# Altium schematic sheet BLV.SchDoc
size 210 x 83 mm
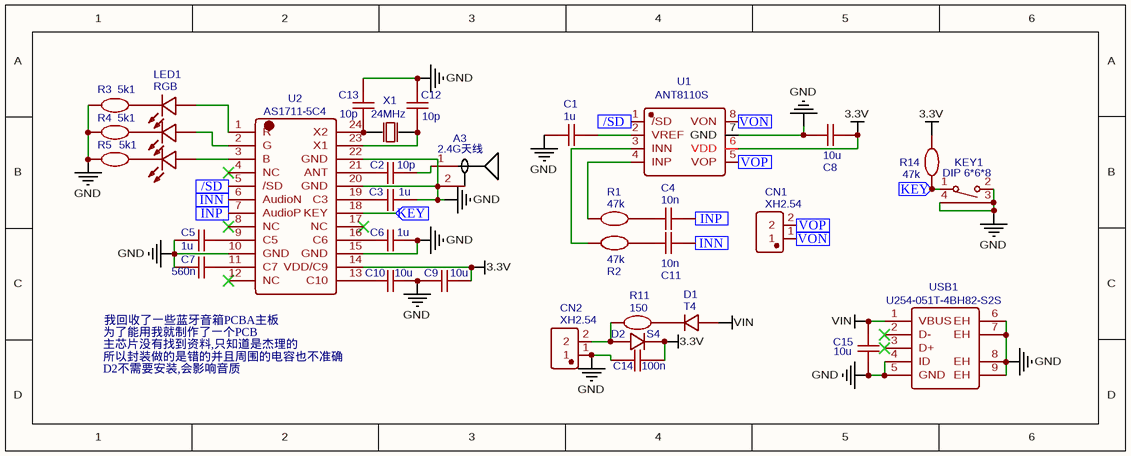
[diagram p0: BLV.SchDoc]

## Parts
A3  2.4G天线  [ANT-RF-BT6-2.4G]
C1  1u  [C0603]
C2  10p  [C0603]
C3  1u  [C0603]
C4  10n  [C0603]
C5  1u  [C0603]
C6  1u  [C0603]
C7  560n  [C0603]
C8  10u  [C0805]
C9  10u  [C0603]
C10  10u  [C0603]
C11  10n  [C0603]
C12  10p  [C0603]
C13  10p  [C0603]
C14  100n  [C0805]
C15  10u  [C0805]
CN1  XH2.54  [XH2.54-LI-2P]
CN2  XH2.54  [XH2.54-LI-2P]
D1  T4  [SOD-123]
D2  S4  [SOD-123]
KEY1  DIP 6*6*8  [TSW DIP-6*6*8]
LED1  RGB  [LED 5050]
R1  47k  [R0603]
R2  47k  [R0603]
R3  5k1  [R0603]
R4  5k1  [R0603]
R5  5k1  [R0603]
R11  150  [R0603]
R14  47k  [R0603]
U1  ANT8110S  [SOP8]
U2  AS1711-5C4  [QSOP24]
USB1  U254-051T-4BH82-S2S  [USB-MICRO_B]
X1  24MHz  [49XSMD]

## Ports
/SD (in), INN (in), INP (in), KEY (in), VON (in), VOP (in)

## Nets
3.3V: C8.1 C9.2 C14.2 D2.1(K) R14.2 U1.6(VDD) U2.14(VDD/C9)
GND: A3.2 C1.2 C3.2 C5.1 C6.2 C7.1 C8.2 C9.1 C10.2 C12.2 C13.2 C14.1 C15.2 CN2.1 KEY1.2 KEY1.3 KEY1.4 R3.1 R4.1 R5.1 U1.7(GND) U2.10(GND) U2.15(GND) U2.20(GND) U2.22(GND) USB1.4(ID) USB1.5(GND) USB1.6(EH) USB1.7(EH) USB1.8(EH) USB1.9(EH)
VIN: C15.1 D1.2(A) USB1.1(VBUS)
/SD: U1.1(/SD) U2.5(/SD) ; port /SD
INN: C11.1 U2.6(AudioN) ; port INN
INP: C4.1 U2.7(AudioP) ; port INP
KEY: KEY1.1 R14.1 U2.18(KEY) ; port KEY
VON: CN1.1 U1.8(VON) ; port VON
VOP: CN1.2 U1.5(VOP) ; port VOP
NetA3_1: A3.1 C2.2
NetC1_1: C1.1 U1.2(VREF)
NetC2_1: C2.1 U2.21(ANT)
NetC3_1: C3.1 U2.19(C3)
NetC4_2: C4.2 R1.2
NetC5_2: C5.2 U2.9(C5)
NetC6_1: C6.1 U2.16(C6)
NetC7_2: C7.2 U2.11(C7)
NetC10_1: C10.1 U2.13(C10)
NetC11_2: C11.2 R2.2
NetC12_1: C12.1 U2.23(X1) X1.2(OSC2)
NetC13_1: C13.1 U2.24(X2) X1.1(OSC1)
NetCN2_2: CN2.2 D2.2(A) R11.1
NetD1_1: D1.1(K) R11.2
NetLED1_1: LED1.1(C) R5.2
NetLED1_2: LED1.2(C) R4.2
NetLED1_3: LED1.3(C) R3.2
NetLED1_4: LED1.4(A) U2.1(R)
NetLED1_5: LED1.5(A) U2.2(G)
NetLED1_6: LED1.6(A) U2.3(B)
NetR1_1: R1.1 U1.4(INP)
NetR2_1: R2.1 U1.3(INN)

Not connected (* = marked no-connect by the designer): U2 4(NC)* 8(NC)* 12(NC)* 17(NC)*; USB1 2(D-)* 3(D+)*

## Notes on the sheet
- 为了能用我就制作了一个PCB
- 我回收了一些蓝牙音箱PCBA主板
- 主芯片没有找到资料,只知道是杰理的
- 所以封装做的是错的并且周围的电容也不准确
- D2不需要安装,会影响音质

## Library data of the parts
A3 = 2.4G天线: BOM_Manufacturer Part: New SchematicLib; Contributor: suanm; spicePre: U; spiceSymbolName: 2.4G天线_右
C1 C3 C5 C6 = 1u: nameAlias: Value(F); Contributor: LCEDA_Lib; spicePre: C
  C1: spiceSymbolName: C_0805_US
  C3 C5 C6: spiceSymbolName: C_0603_US
C2 C12 C13 = 10p: nameAlias: Value(F); Contributor: LCEDA_Lib; spicePre: C; spiceSymbolName: C_0603_US
C4 C11 = 22n: nameAlias: Value(F); Contributor: LCEDA_Lib; spicePre: C; spiceSymbolName: C_0603_US
C7 = 560n: nameAlias: Value(F); Contributor: LCEDA_Lib; spicePre: C; spiceSymbolName: C_0603_US
C8-C10 C15 = 10u: nameAlias: Value(F); Contributor: LCEDA_Lib; spicePre: C
  C8 C15: spiceSymbolName: C_0805_US
  C9 C10: spiceSymbolName: C_0603_US
C14 = 100n: nameAlias: Value(F); Contributor: LCEDA_Lib; spicePre: C; spiceSymbolName: C_0805_US
CN1 CN2 = XH2.54: BOM_Manufacturer: null; BOM_Manufacturer Part: CONN-TH_XH-2A; Contributor: LCSC; BOM_Supplier: LCSC; BOM_Supplier Part: C9900010848; BOM_JLCPCB Part Class: Extended Part; spicePre: C; spiceSymbolName: CONN-TH_XH-2A_C9900010848
D1 = T4: BOM_Manufacturer: CJ; BOM_Manufacturer Part: 1N4148W T4; Contributor: 立创EDA官方封装库; BOM_Supplier: LCSC; BOM_Supplier Part: C2099; BOM_JLCPCB Part Class: Extended Part; spicePre: D; spiceSymbolName: 1N4148W T4
D2 = S4: BOM_Manufacturer: CJ; BOM_Manufacturer Part: 1N4148W T4; Contributor: 立创EDA官方封装库; BOM_Supplier: LCSC; BOM_Supplier Part: C2099; BOM_JLCPCB Part Class: Extended Part; spicePre: D; spiceSymbolName: 1N4148W T4
KEY1 = DIP 6*6*8: BOM_Manufacturer: 韩国韩荣; BOM_Manufacturer Part: K2-1102AQ-H4CW-01; Contributor: LCSC; BOM_Supplier: LCSC; BOM_Supplier Part: C961738; BOM_JLCPCB Part Class: Extended Part; spicePre: S; spiceSymbolName: K2-1102AQ-H4CW-01
LED1 = RGB: BOM_Manufacturer: Hongli Zhihui (HONGLITRONIC); BOM_Manufacturer Part: HL-AF-5060H271BU46FU79GC-S1-THL; Contributor: LCSC; BOM_Supplier: LCSC; BOM_Supplier Part: C219409; BOM_JLCPCB Part Class: Extended Part; spicePre: L; spiceSymbolName: HL-AF-5060H271BU46FU79GC-S1-THL
R1 R2 = 22k: nameAlias: Value(Ω); Contributor: LCEDA_Lib; spicePre: R; spiceSymbolName: R_0603_EU
R3-R5 = 5k1: nameAlias: Value(Ω); Contributor: LCEDA_Lib; spicePre: R; spiceSymbolName: R_0603_EU
R11 = 150: nameAlias: Value(Ω); Contributor: LCEDA_Lib; spicePre: R; spiceSymbolName: R_0603_EU
R14 = 4k7: nameAlias: Value(Ω); Contributor: LCEDA_Lib; spicePre: R; spiceSymbolName: R_0603_EU
U1 = ANT8110S: BOM_Manufacturer: null; Contributor: LCSC; BOM_Supplier: LCSC; BOM_Supplier Part: C9900000568; BOM_Manufacturer Part: ANT8110S; BOM_JLCPCB Part Class: Extended Part; spicePre: U; spiceSymbolName: ANT8110S
U2 = AS1711-5C4: Contributor: lekee085; BOM_Supplier: JL杰理; spicePre: U; spiceSymbolName: AS1711-5C4
USB1 = U254-051T-4BH82-S2S: BOM_Manufacturer: XKB Connectivity(中国星坤); Contributor: LCSC; BOM_Supplier: LCSC; BOM_Supplier Part: C908456; BOM_Manufacturer Part: U254-051T-4BH82-S2S; BOM_JLCPCB Part Class: Extended Part; spicePre: U; spiceSymbolName: U254-051T-4BH82-S2S
X1 = 24MHz: BOM_Manufacturer: Yangxing Tech; BOM_Manufacturer Part: X49XM24MOB2SC; nameAlias: Frequency; Contributor: LCSC; BOM_Supplier: LCSC; BOM_Supplier Part: C412889; BOM_JLCPCB Part Class: Extended Part; spicePre: X; spiceSymbolName: X49XM24MOB2SC